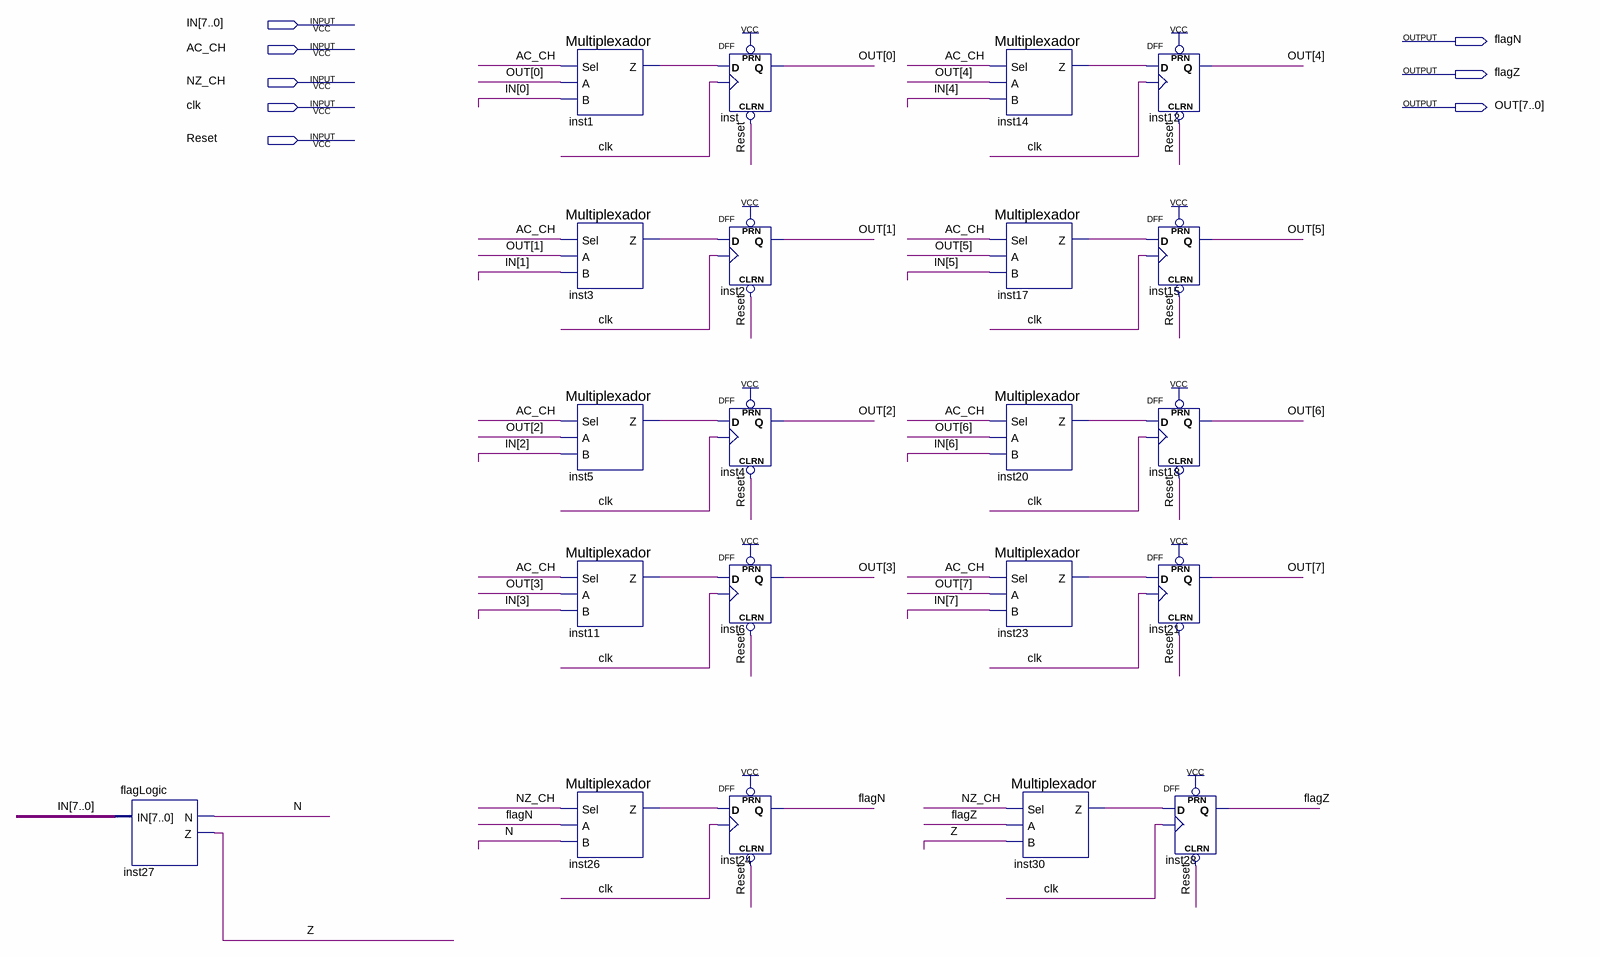
[diagram p0: schematic sheet]
// Quartus schematic AC.bdf as structural Verilog: 21 symbols, 8 pins
module AC (
  input  [7:0] IN,
  input  AC_CH,
  input  NZ_CH,
  input  clk,
  input  Reset,
  output flagN,
  output flagZ,
  output [7:0] OUT
);

  wire inst1_z, inst3_z, inst5_z, inst11_z, inst14_z, inst17_z, inst20_z, inst23_z, inst26_z, inst30_z, N, Z;

  flagLogic inst27 (.IN(IN), .N(N), .Z(Z));
  Multiplexador inst1 (.Sel(AC_CH), .A(OUT[0]), .B(IN[0]), .Z(inst1_z));
  Multiplexador inst3 (.Sel(AC_CH), .A(OUT[1]), .B(IN[1]), .Z(inst3_z));
  Multiplexador inst5 (.Sel(AC_CH), .A(OUT[2]), .B(IN[2]), .Z(inst5_z));
  Multiplexador inst11 (.Sel(AC_CH), .A(OUT[3]), .B(IN[3]), .Z(inst11_z));
  Multiplexador inst26 (.Sel(NZ_CH), .A(flagN), .B(N), .Z(inst26_z));
  DFF inst (.CLRN(Reset), .CLK(clk), .D(inst1_z), .PRN(1'b1), .Q(OUT[0]));
  DFF inst2 (.CLRN(Reset), .CLK(clk), .D(inst3_z), .PRN(1'b1), .Q(OUT[1]));
  DFF inst4 (.CLRN(Reset), .CLK(clk), .D(inst5_z), .PRN(1'b1), .Q(OUT[2]));
  DFF inst6 (.CLRN(Reset), .CLK(clk), .D(inst11_z), .PRN(1'b1), .Q(OUT[3]));
  DFF inst24 (.CLRN(Reset), .CLK(clk), .D(inst26_z), .PRN(1'b1), .Q(flagN));
  Multiplexador inst14 (.Sel(AC_CH), .A(OUT[4]), .B(IN[4]), .Z(inst14_z));
  Multiplexador inst17 (.Sel(AC_CH), .A(OUT[5]), .B(IN[5]), .Z(inst17_z));
  Multiplexador inst20 (.Sel(AC_CH), .A(OUT[6]), .B(IN[6]), .Z(inst20_z));
  Multiplexador inst23 (.Sel(AC_CH), .A(OUT[7]), .B(IN[7]), .Z(inst23_z));
  Multiplexador inst30 (.Sel(NZ_CH), .A(flagZ), .B(Z), .Z(inst30_z));
  DFF inst12 (.CLRN(Reset), .CLK(clk), .D(inst14_z), .PRN(1'b1), .Q(OUT[4]));
  DFF inst15 (.CLRN(Reset), .CLK(clk), .D(inst17_z), .PRN(1'b1), .Q(OUT[5]));
  DFF inst18 (.CLRN(Reset), .CLK(clk), .D(inst20_z), .PRN(1'b1), .Q(OUT[6]));
  DFF inst21 (.CLRN(Reset), .CLK(clk), .D(inst23_z), .PRN(1'b1), .Q(OUT[7]));
  DFF inst28 (.CLRN(Reset), .CLK(clk), .D(inst30_z), .PRN(1'b1), .Q(flagZ));
endmodule
